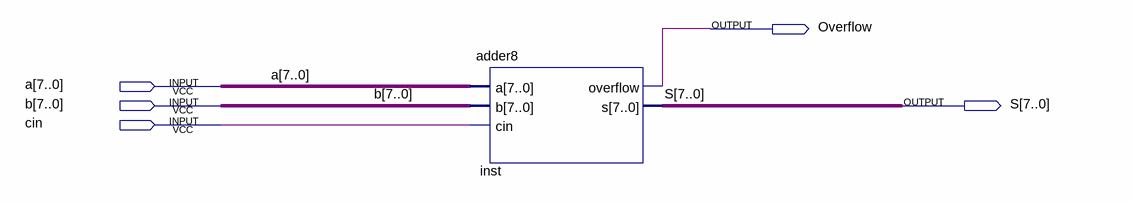
[diagram p0: schematic sheet]
// Quartus schematic soma8.bdf as structural Verilog: 1 symbols, 5 pins
module soma8 (
  input  [7:0] a,
  input  [7:0] b,
  input  cin,
  output Overflow,
  output [7:0] S
);

  adder8 inst (.a(a), .b(b), .cin(cin), .overflow(Overflow), .s(S));
endmodule
